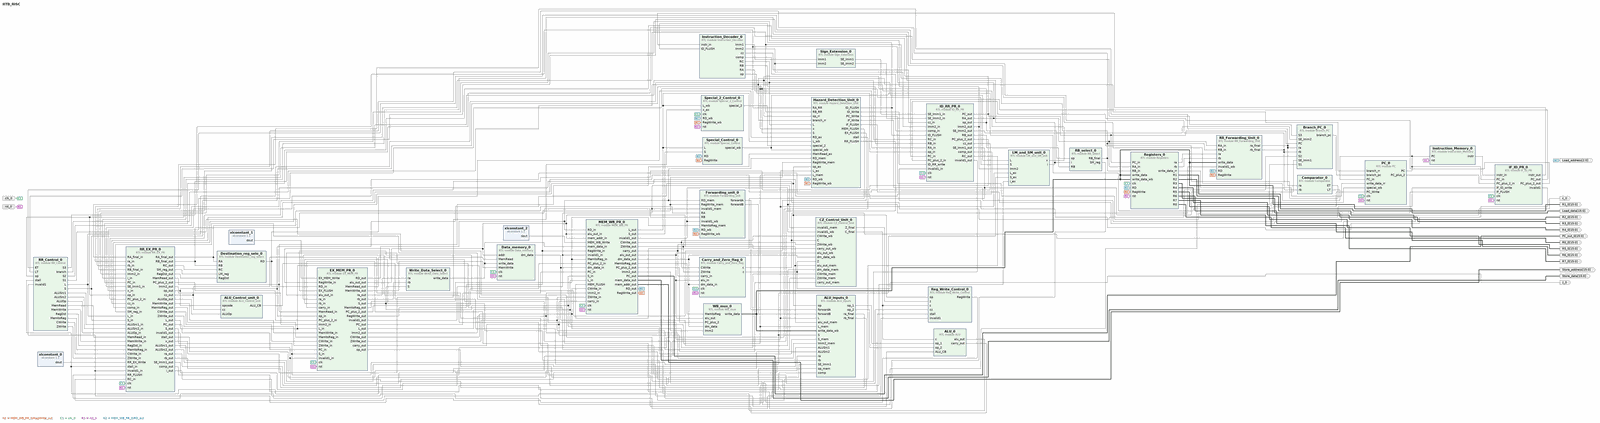
[diagram p0: block diagram of the top level, whole]
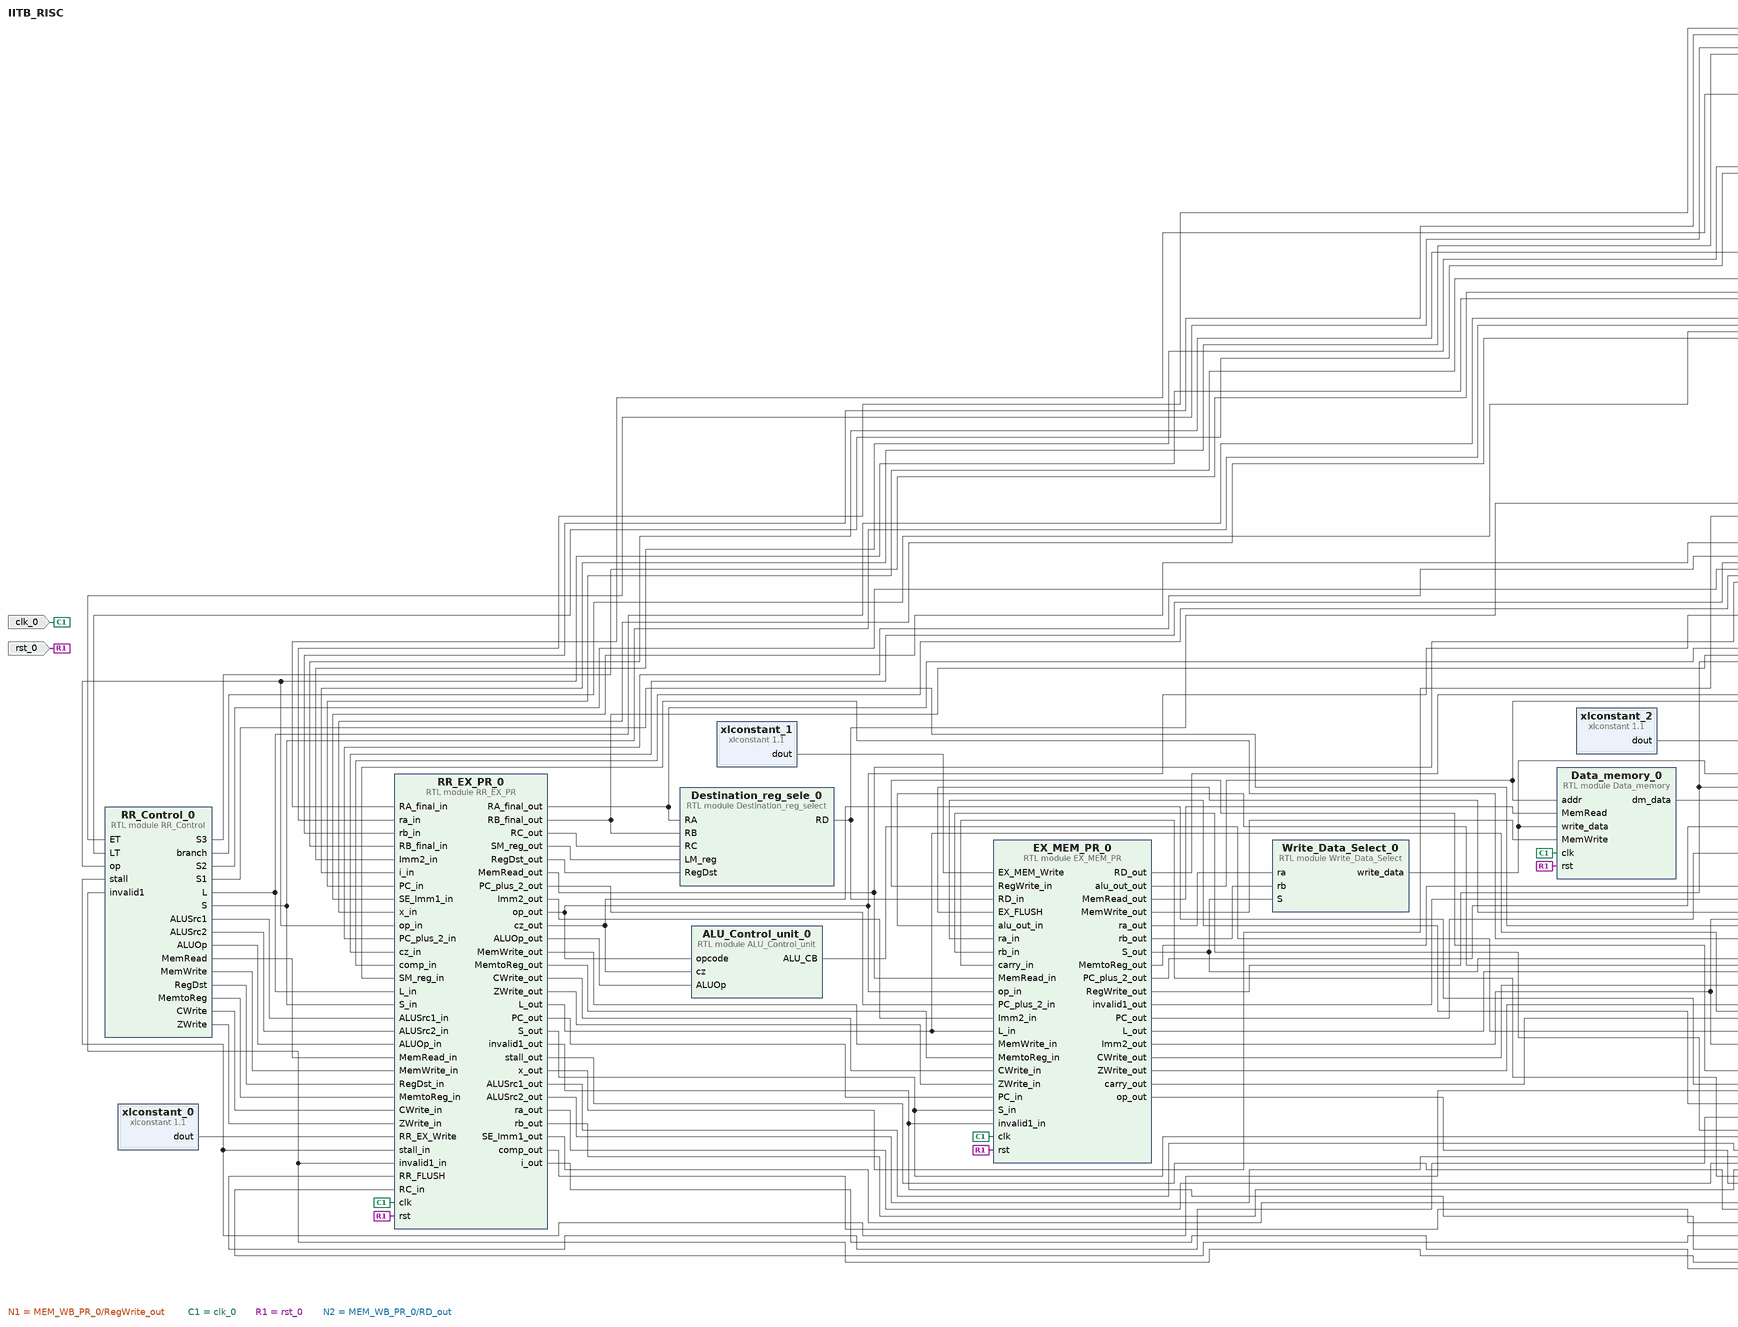
[diagram p1: block diagram of the top level, left part]
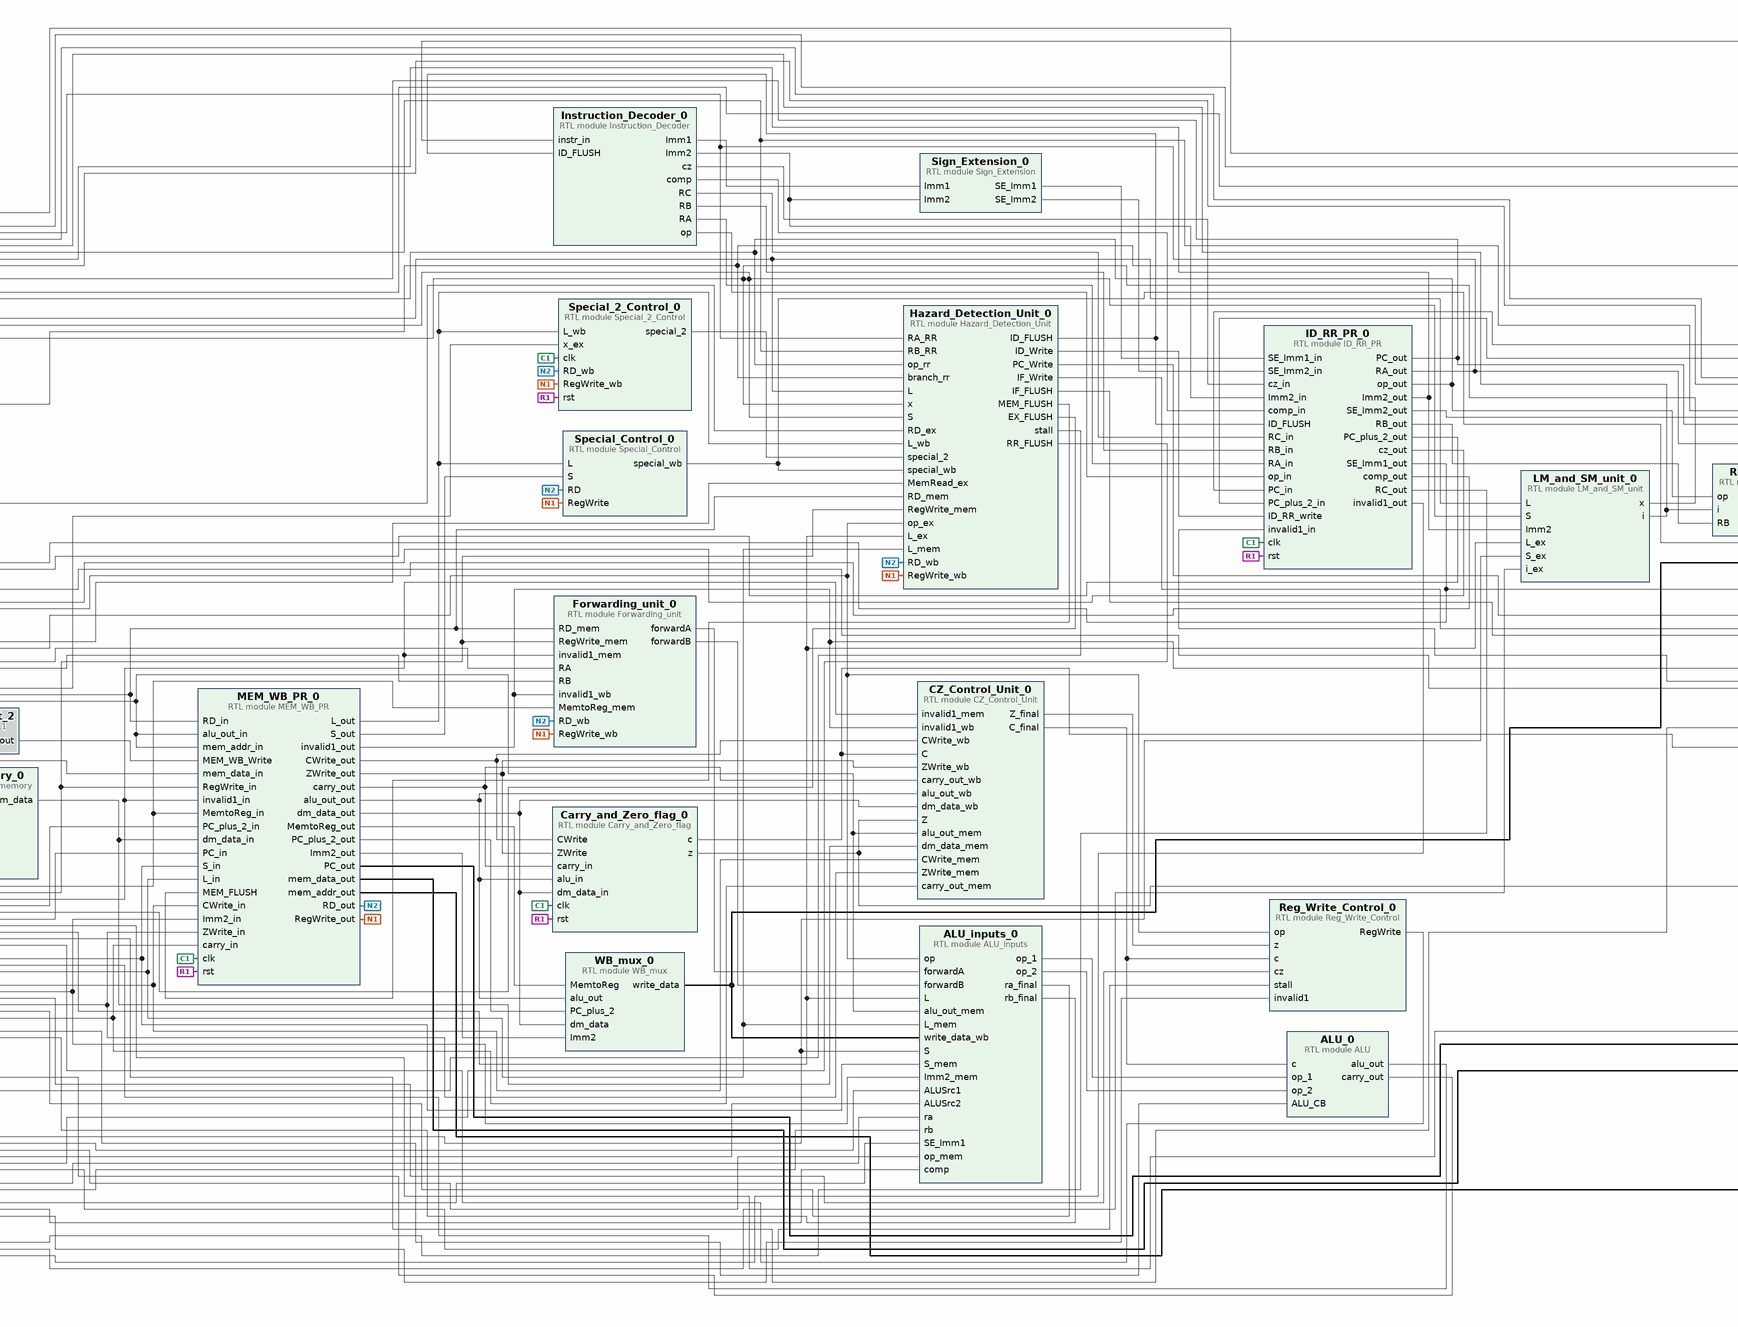
[diagram p2: block diagram of the top level, centre part]
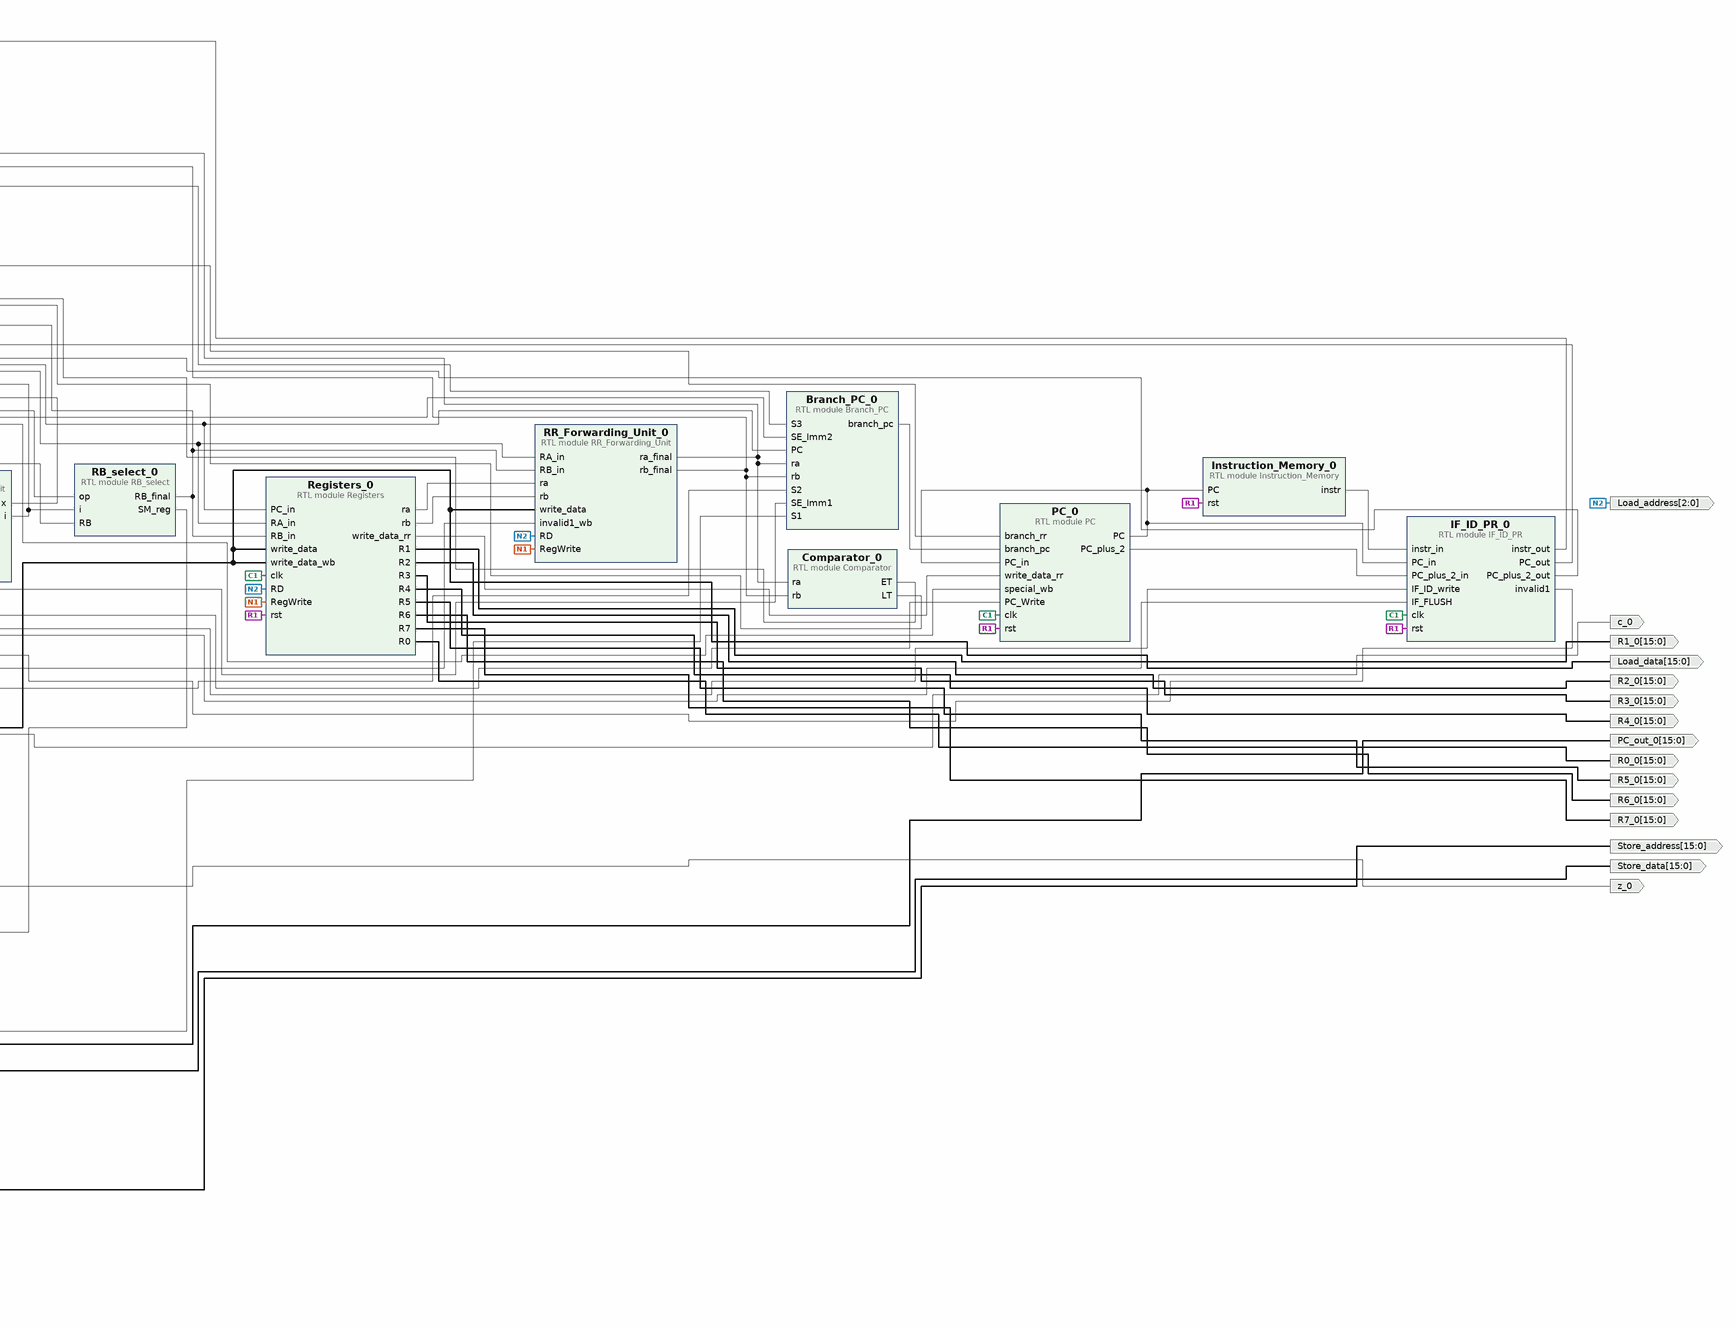
[diagram p3: block diagram of the top level, right part]
# Vivado block design IITB_RISC, xc7k70tfbv676-1, Vivado 2019.1
create_bd_design IITB_RISC

create_bd_port -dir I -type clk clk_0
create_bd_port -dir I -type rst rst_0
create_bd_port -dir O -from 15 -to 0 R1_0
create_bd_port -dir O -from 15 -to 0 R2_0
create_bd_port -dir O -from 15 -to 0 R3_0
create_bd_port -dir O -from 15 -to 0 R4_0
create_bd_port -dir O -from 15 -to 0 R5_0
create_bd_port -dir O -from 15 -to 0 R6_0
create_bd_port -dir O -from 15 -to 0 R7_0
create_bd_port -dir O -from 15 -to 0 PC_out_0
create_bd_port -dir O c_0
create_bd_port -dir O z_0
create_bd_port -dir O -from 15 -to 0 Load_data
create_bd_port -dir O -from 2 -to 0 Load_address
create_bd_port -dir O -from 15 -to 0 Store_data
create_bd_port -dir O -from 15 -to 0 Store_address
create_bd_port -dir O -from 15 -to 0 R0_0

create_bd_cell -type module -reference PC PC_0
create_bd_cell -type module -reference Sign_Extension Sign_Extension_0
create_bd_cell -type module -reference Comparator Comparator_0
create_bd_cell -type module -reference ALU_Control_unit ALU_Control_unit_0
create_bd_cell -type module -reference Destination_reg_select Destination_reg_sele_0
create_bd_cell -type module -reference Write_Data_Select Write_Data_Select_0
create_bd_cell -type module -reference WB_mux WB_mux_0
create_bd_cell -type module -reference Special_Control Special_Control_0
create_bd_cell -type ip -vlnv xilinx.com:ip:xlconstant:1.1 xlconstant_0
create_bd_cell -type ip -vlnv xilinx.com:ip:xlconstant:1.1 xlconstant_1
create_bd_cell -type ip -vlnv xilinx.com:ip:xlconstant:1.1 xlconstant_2
create_bd_cell -type module -reference Instruction_Decoder Instruction_Decoder_0
create_bd_cell -type module -reference Branch_PC Branch_PC_0
create_bd_cell -type module -reference ALU ALU_0
create_bd_cell -type module -reference ALU_inputs ALU_inputs_0
create_bd_cell -type module -reference RB_select RB_select_0
create_bd_cell -type module -reference LM_and_SM_unit LM_and_SM_unit_0
create_bd_cell -type module -reference Instruction_Memory Instruction_Memory_0
create_bd_cell -type module -reference Data_memory Data_memory_0
create_bd_cell -type module -reference Special_2_Control Special_2_Control_0
create_bd_cell -type module -reference Hazard_Detection_Unit Hazard_Detection_Unit_0
create_bd_cell -type module -reference Registers Registers_0
create_bd_cell -type module -reference ID_RR_PR ID_RR_PR_0
create_bd_cell -type module -reference IF_ID_PR IF_ID_PR_0
create_bd_cell -type module -reference Forwarding_unit Forwarding_unit_0
create_bd_cell -type module -reference Carry_and_Zero_flag Carry_and_Zero_flag_0
create_bd_cell -type module -reference CZ_Control_Unit CZ_Control_Unit_0
create_bd_cell -type module -reference MEM_WB_PR MEM_WB_PR_0
create_bd_cell -type module -reference EX_MEM_PR EX_MEM_PR_0
create_bd_cell -type module -reference RR_EX_PR RR_EX_PR_0
create_bd_cell -type module -reference Reg_Write_Control Reg_Write_Control_0
create_bd_cell -type module -reference RR_Control RR_Control_0
create_bd_cell -type module -reference RR_Forwarding_Unit RR_Forwarding_Unit_0

# ---- connections ----

connect_bd_net [get_bd_pins Instruction_Memory_0/instr] [get_bd_pins IF_ID_PR_0/instr_in]
connect_bd_net [get_bd_pins PC_0/PC_plus_2] [get_bd_pins IF_ID_PR_0/PC_plus_2_in]
connect_bd_net [get_bd_pins IF_ID_PR_0/instr_out] [get_bd_pins Instruction_Decoder_0/instr_in]
connect_bd_net [get_bd_pins Instruction_Decoder_0/Imm1] [get_bd_pins Sign_Extension_0/Imm1]
connect_bd_net [get_bd_pins Instruction_Decoder_0/Imm2] [get_bd_pins Sign_Extension_0/Imm2] [get_bd_pins ID_RR_PR_0/Imm2_in]
connect_bd_net [get_bd_pins Sign_Extension_0/SE_Imm1] [get_bd_pins ID_RR_PR_0/SE_Imm1_in]
connect_bd_net [get_bd_pins Sign_Extension_0/SE_Imm2] [get_bd_pins ID_RR_PR_0/SE_Imm2_in]
connect_bd_net [get_bd_pins Instruction_Decoder_0/cz] [get_bd_pins ID_RR_PR_0/cz_in]
connect_bd_net [get_bd_pins Instruction_Decoder_0/comp] [get_bd_pins ID_RR_PR_0/comp_in]
connect_bd_net [get_bd_pins Instruction_Decoder_0/RC] [get_bd_pins ID_RR_PR_0/RC_in]
connect_bd_net [get_bd_pins Instruction_Decoder_0/RB] [get_bd_pins ID_RR_PR_0/RB_in]
connect_bd_net [get_bd_pins Instruction_Decoder_0/RA] [get_bd_pins ID_RR_PR_0/RA_in]
connect_bd_net [get_bd_pins Instruction_Decoder_0/op] [get_bd_pins ID_RR_PR_0/op_in]
connect_bd_net [get_bd_pins IF_ID_PR_0/PC_out] [get_bd_pins ID_RR_PR_0/PC_in]
connect_bd_net [get_bd_pins IF_ID_PR_0/PC_plus_2_out] [get_bd_pins ID_RR_PR_0/PC_plus_2_in]
connect_bd_net [get_bd_pins ID_RR_PR_0/RA_out] \
  [get_bd_pins Hazard_Detection_Unit_0/RA_RR] [get_bd_pins Registers_0/RA_in] [get_bd_pins RR_EX_PR_0/RA_final_in] \
  [get_bd_pins RR_Forwarding_Unit_0/RA_in]
connect_bd_net -net Registers_0_ra [get_bd_pins RR_Forwarding_Unit_0/ra_final] \
  [get_bd_pins Comparator_0/ra] [get_bd_pins Branch_PC_0/ra] [get_bd_pins RR_EX_PR_0/ra_in]
connect_bd_net -net Registers_0_rb [get_bd_pins RR_Forwarding_Unit_0/rb_final] \
  [get_bd_pins Comparator_0/rb] [get_bd_pins Branch_PC_0/rb] [get_bd_pins RR_EX_PR_0/rb_in]
connect_bd_net [get_bd_pins RB_select_0/RB_final] \
  [get_bd_pins Hazard_Detection_Unit_0/RB_RR] [get_bd_pins Registers_0/RB_in] [get_bd_pins RR_EX_PR_0/RB_final_in] \
  [get_bd_pins RR_Forwarding_Unit_0/RB_in]
connect_bd_net [get_bd_pins ID_RR_PR_0/RB_out] [get_bd_pins RB_select_0/RB]
connect_bd_net [get_bd_pins ID_RR_PR_0/op_out] \
  [get_bd_pins RB_select_0/op] [get_bd_pins Hazard_Detection_Unit_0/op_rr] [get_bd_pins RR_EX_PR_0/op_in] \
  [get_bd_pins RR_Control_0/op]
connect_bd_net [get_bd_pins ID_RR_PR_0/Imm2_out] [get_bd_pins LM_and_SM_unit_0/Imm2] [get_bd_pins RR_EX_PR_0/Imm2_in]
connect_bd_net [get_bd_pins RR_Control_0/L] [get_bd_pins LM_and_SM_unit_0/L] [get_bd_pins Hazard_Detection_Unit_0/L] [get_bd_pins RR_EX_PR_0/L_in]
connect_bd_net [get_bd_pins RR_Control_0/S] [get_bd_pins LM_and_SM_unit_0/S] [get_bd_pins Hazard_Detection_Unit_0/S] [get_bd_pins RR_EX_PR_0/S_in]
connect_bd_net [get_bd_pins LM_and_SM_unit_0/i] [get_bd_pins RB_select_0/i] [get_bd_pins RR_EX_PR_0/i_in]
connect_bd_net [get_bd_pins Comparator_0/ET] [get_bd_pins RR_Control_0/ET]
connect_bd_net [get_bd_pins Comparator_0/LT] [get_bd_pins RR_Control_0/LT]
connect_bd_net [get_bd_pins ID_RR_PR_0/PC_out] [get_bd_pins Branch_PC_0/PC] [get_bd_pins Registers_0/PC_in] [get_bd_pins RR_EX_PR_0/PC_in]
connect_bd_net [get_bd_pins Registers_0/write_data_rr] [get_bd_pins PC_0/write_data_rr]
connect_bd_net [get_bd_pins RR_Control_0/S3] [get_bd_pins Branch_PC_0/S3]
connect_bd_net [get_bd_pins RR_Control_0/S2] [get_bd_pins Branch_PC_0/S2]
connect_bd_net [get_bd_pins RR_Control_0/S1] [get_bd_pins Branch_PC_0/S1]
connect_bd_net [get_bd_pins ID_RR_PR_0/SE_Imm1_out] [get_bd_pins Branch_PC_0/SE_Imm1] [get_bd_pins RR_EX_PR_0/SE_Imm1_in]
connect_bd_net [get_bd_pins ID_RR_PR_0/SE_Imm2_out] [get_bd_pins Branch_PC_0/SE_Imm2]
connect_bd_net [get_bd_pins LM_and_SM_unit_0/x] [get_bd_pins Hazard_Detection_Unit_0/x] [get_bd_pins RR_EX_PR_0/x_in]
connect_bd_net [get_bd_pins ID_RR_PR_0/PC_plus_2_out] [get_bd_pins RR_EX_PR_0/PC_plus_2_in]
connect_bd_net [get_bd_pins RR_Control_0/ALUSrc1] [get_bd_pins RR_EX_PR_0/ALUSrc1_in]
connect_bd_net [get_bd_pins RR_Control_0/ALUSrc2] [get_bd_pins RR_EX_PR_0/ALUSrc2_in]
connect_bd_net [get_bd_pins RR_Control_0/ALUOp] [get_bd_pins RR_EX_PR_0/ALUOp_in]
connect_bd_net [get_bd_pins RR_Control_0/MemRead] [get_bd_pins RR_EX_PR_0/MemRead_in]
connect_bd_net [get_bd_pins RR_Control_0/MemWrite] [get_bd_pins RR_EX_PR_0/MemWrite_in]
connect_bd_net [get_bd_pins RR_Control_0/RegDst] [get_bd_pins RR_EX_PR_0/RegDst_in]
connect_bd_net [get_bd_pins RR_Control_0/MemtoReg] [get_bd_pins RR_EX_PR_0/MemtoReg_in]
connect_bd_net [get_bd_pins RR_Control_0/branch] [get_bd_pins PC_0/branch_rr] [get_bd_pins Hazard_Detection_Unit_0/branch_rr]
connect_bd_net [get_bd_pins Branch_PC_0/branch_pc] [get_bd_pins PC_0/branch_pc]
connect_bd_net [get_bd_pins ID_RR_PR_0/cz_out] [get_bd_pins RR_EX_PR_0/cz_in]
connect_bd_net [get_bd_pins ID_RR_PR_0/comp_out] [get_bd_pins RR_EX_PR_0/comp_in]
connect_bd_net [get_bd_pins RB_select_0/SM_reg] [get_bd_pins RR_EX_PR_0/SM_reg_in]
connect_bd_net [get_bd_pins ALU_inputs_0/op_1] [get_bd_pins ALU_0/op_1]
connect_bd_net [get_bd_pins ALU_inputs_0/op_2] [get_bd_pins ALU_0/op_2]
connect_bd_net [get_bd_pins ALU_Control_unit_0/ALU_CB] [get_bd_pins ALU_0/ALU_CB]
connect_bd_net -net Carry_and_Zero_flag_0_c [get_bd_pins CZ_Control_Unit_0/C_final] [get_bd_pins ALU_0/c] [get_bd_pins Reg_Write_Control_0/c]
connect_bd_net [get_bd_pins RR_EX_PR_0/stall_out] [get_bd_pins Reg_Write_Control_0/stall]
connect_bd_net [get_bd_pins RR_EX_PR_0/op_out] \
  [get_bd_pins ALU_Control_unit_0/opcode] [get_bd_pins ALU_inputs_0/op] [get_bd_pins Hazard_Detection_Unit_0/op_ex] \
  [get_bd_pins EX_MEM_PR_0/op_in] [get_bd_pins Reg_Write_Control_0/op]
connect_bd_net [get_bd_pins RR_EX_PR_0/cz_out] [get_bd_pins ALU_Control_unit_0/cz] [get_bd_pins Reg_Write_Control_0/cz]
connect_bd_net [get_bd_pins Reg_Write_Control_0/RegWrite] [get_bd_pins EX_MEM_PR_0/RegWrite_in]
connect_bd_net [get_bd_pins ALU_0/alu_out] [get_bd_pins EX_MEM_PR_0/alu_out_in]
connect_bd_net [get_bd_pins RR_EX_PR_0/RA_final_out] [get_bd_pins Destination_reg_sele_0/RA] [get_bd_pins Forwarding_unit_0/RA]
connect_bd_net [get_bd_pins RR_EX_PR_0/RB_final_out] [get_bd_pins Destination_reg_sele_0/RB] [get_bd_pins Forwarding_unit_0/RB]
connect_bd_net [get_bd_pins RR_EX_PR_0/RC_out] [get_bd_pins Destination_reg_sele_0/RC]
connect_bd_net [get_bd_pins RR_EX_PR_0/SM_reg_out] [get_bd_pins Destination_reg_sele_0/LM_reg]
connect_bd_net [get_bd_pins Destination_reg_sele_0/RD] [get_bd_pins Hazard_Detection_Unit_0/RD_ex] [get_bd_pins EX_MEM_PR_0/RD_in]
connect_bd_net [get_bd_pins RR_EX_PR_0/RegDst_out] [get_bd_pins Destination_reg_sele_0/RegDst]
connect_bd_net [get_bd_pins RR_EX_PR_0/ALUSrc1_out] [get_bd_pins ALU_inputs_0/ALUSrc1]
connect_bd_net [get_bd_pins RR_EX_PR_0/ALUSrc2_out] [get_bd_pins ALU_inputs_0/ALUSrc2]
connect_bd_net [get_bd_pins RR_EX_PR_0/ALUOp_out] [get_bd_pins ALU_Control_unit_0/ALUOp]
connect_bd_net [get_bd_pins RR_EX_PR_0/ra_out] [get_bd_pins ALU_inputs_0/ra]
connect_bd_net [get_bd_pins RR_EX_PR_0/rb_out] [get_bd_pins ALU_inputs_0/rb]
connect_bd_net [get_bd_pins RR_EX_PR_0/SE_Imm1_out] [get_bd_pins ALU_inputs_0/SE_Imm1]
connect_bd_net [get_bd_pins RR_EX_PR_0/comp_out] [get_bd_pins ALU_inputs_0/comp]
connect_bd_net [get_bd_pins Forwarding_unit_0/forwardA] [get_bd_pins ALU_inputs_0/forwardA]
connect_bd_net [get_bd_pins Forwarding_unit_0/forwardB] [get_bd_pins ALU_inputs_0/forwardB]
connect_bd_net [get_bd_pins RR_EX_PR_0/PC_plus_2_out] [get_bd_pins EX_MEM_PR_0/PC_plus_2_in]
connect_bd_net [get_bd_pins RR_EX_PR_0/Imm2_out] [get_bd_pins EX_MEM_PR_0/Imm2_in]
connect_bd_net [get_bd_pins RR_EX_PR_0/L_out] \
  [get_bd_pins ALU_inputs_0/L] [get_bd_pins LM_and_SM_unit_0/L_ex] [get_bd_pins Hazard_Detection_Unit_0/L_ex] \
  [get_bd_pins EX_MEM_PR_0/L_in]
connect_bd_net [get_bd_pins RR_EX_PR_0/S_out] [get_bd_pins ALU_inputs_0/S] [get_bd_pins LM_and_SM_unit_0/S_ex] [get_bd_pins EX_MEM_PR_0/S_in]
connect_bd_net [get_bd_pins RR_EX_PR_0/MemRead_out] [get_bd_pins Hazard_Detection_Unit_0/MemRead_ex] [get_bd_pins EX_MEM_PR_0/MemRead_in]
connect_bd_net [get_bd_pins RR_EX_PR_0/MemWrite_out] [get_bd_pins EX_MEM_PR_0/MemWrite_in]
connect_bd_net [get_bd_pins RR_EX_PR_0/MemtoReg_out] [get_bd_pins EX_MEM_PR_0/MemtoReg_in]
connect_bd_net [get_bd_pins EX_MEM_PR_0/alu_out_out] \
  [get_bd_pins ALU_inputs_0/alu_out_mem] [get_bd_pins Data_memory_0/addr] [get_bd_pins CZ_Control_Unit_0/alu_out_mem] \
  [get_bd_pins MEM_WB_PR_0/alu_out_in] [get_bd_pins MEM_WB_PR_0/mem_addr_in]
connect_bd_net [get_bd_pins EX_MEM_PR_0/RD_out] \
  [get_bd_pins Hazard_Detection_Unit_0/RD_mem] [get_bd_pins Forwarding_unit_0/RD_mem] [get_bd_pins MEM_WB_PR_0/RD_in]
connect_bd_net [get_bd_pins EX_MEM_PR_0/L_out] \
  [get_bd_pins ALU_inputs_0/L_mem] [get_bd_pins Hazard_Detection_Unit_0/L_mem] [get_bd_pins MEM_WB_PR_0/L_in]
connect_bd_net [get_bd_pins EX_MEM_PR_0/S_out] [get_bd_pins Write_Data_Select_0/S] [get_bd_pins ALU_inputs_0/S_mem] [get_bd_pins MEM_WB_PR_0/S_in]
connect_bd_net [get_bd_pins EX_MEM_PR_0/MemRead_out] [get_bd_pins Data_memory_0/MemRead]
connect_bd_net [get_bd_pins EX_MEM_PR_0/MemWrite_out] [get_bd_pins Data_memory_0/MemWrite]
connect_bd_net [get_bd_pins EX_MEM_PR_0/MemtoReg_out] [get_bd_pins Forwarding_unit_0/MemtoReg_mem] [get_bd_pins MEM_WB_PR_0/MemtoReg_in]
connect_bd_net [get_bd_pins Write_Data_Select_0/write_data] [get_bd_pins Data_memory_0/write_data] [get_bd_pins MEM_WB_PR_0/mem_data_in]
connect_bd_net [get_bd_pins EX_MEM_PR_0/ra_out] [get_bd_pins Write_Data_Select_0/ra]
connect_bd_net [get_bd_pins EX_MEM_PR_0/rb_out] [get_bd_pins Write_Data_Select_0/rb]
connect_bd_net [get_bd_pins Data_memory_0/dm_data] [get_bd_pins CZ_Control_Unit_0/dm_data_mem] [get_bd_pins MEM_WB_PR_0/dm_data_in]
connect_bd_net [get_bd_pins EX_MEM_PR_0/PC_plus_2_out] [get_bd_pins MEM_WB_PR_0/PC_plus_2_in]
connect_bd_net [get_bd_pins EX_MEM_PR_0/Imm2_out] [get_bd_pins ALU_inputs_0/Imm2_mem] [get_bd_pins MEM_WB_PR_0/Imm2_in]
connect_bd_net [get_bd_pins EX_MEM_PR_0/RegWrite_out] \
  [get_bd_pins Hazard_Detection_Unit_0/RegWrite_mem] [get_bd_pins Forwarding_unit_0/RegWrite_mem] \
  [get_bd_pins MEM_WB_PR_0/RegWrite_in]
connect_bd_net [get_bd_pins MEM_WB_PR_0/MemtoReg_out] [get_bd_pins WB_mux_0/MemtoReg]
connect_bd_net [get_bd_pins MEM_WB_PR_0/alu_out_out] \
  [get_bd_pins WB_mux_0/alu_out] [get_bd_pins Carry_and_Zero_flag_0/alu_in] [get_bd_pins CZ_Control_Unit_0/alu_out_wb]
connect_bd_net [get_bd_pins MEM_WB_PR_0/dm_data_out] \
  [get_bd_pins WB_mux_0/dm_data] [get_bd_pins Carry_and_Zero_flag_0/dm_data_in] [get_bd_pins CZ_Control_Unit_0/dm_data_wb]
connect_bd_net [get_bd_pins MEM_WB_PR_0/PC_plus_2_out] [get_bd_pins WB_mux_0/PC_plus_2]
connect_bd_net [get_bd_pins MEM_WB_PR_0/Imm2_out] [get_bd_pins WB_mux_0/Imm2]
connect_bd_net [get_bd_pins MEM_WB_PR_0/RegWrite_out] \
  [get_bd_pins Special_Control_0/RegWrite] [get_bd_pins Special_2_Control_0/RegWrite_wb] \
  [get_bd_pins Hazard_Detection_Unit_0/RegWrite_wb] [get_bd_pins Registers_0/RegWrite] \
  [get_bd_pins Forwarding_unit_0/RegWrite_wb] [get_bd_pins RR_Forwarding_Unit_0/RegWrite]
connect_bd_net [get_bd_pins MEM_WB_PR_0/L_out] \
  [get_bd_pins Special_Control_0/L] [get_bd_pins Special_2_Control_0/L_wb] [get_bd_pins Hazard_Detection_Unit_0/L_wb]
connect_bd_net [get_bd_pins MEM_WB_PR_0/S_out] [get_bd_pins Special_Control_0/S]
connect_bd_net [get_bd_pins RR_EX_PR_0/x_out] [get_bd_pins Special_2_Control_0/x_ex]
connect_bd_net [get_bd_pins Special_Control_0/special_wb] [get_bd_pins PC_0/special_wb] [get_bd_pins Hazard_Detection_Unit_0/special_wb]
connect_bd_net [get_bd_pins Special_2_Control_0/special_2] [get_bd_pins Hazard_Detection_Unit_0/special_2]
connect_bd_net [get_bd_pins Hazard_Detection_Unit_0/PC_Write] [get_bd_pins PC_0/PC_Write]
connect_bd_net [get_bd_pins Hazard_Detection_Unit_0/IF_Write] [get_bd_pins IF_ID_PR_0/IF_ID_write]
connect_bd_net [get_bd_pins Hazard_Detection_Unit_0/ID_Write] [get_bd_pins ID_RR_PR_0/ID_RR_write]
connect_bd_net [get_bd_pins Hazard_Detection_Unit_0/stall] [get_bd_pins RR_EX_PR_0/stall_in] [get_bd_pins RR_Control_0/stall]
connect_bd_net [get_bd_pins Hazard_Detection_Unit_0/IF_FLUSH] [get_bd_pins IF_ID_PR_0/IF_FLUSH]
connect_bd_net [get_bd_pins Hazard_Detection_Unit_0/ID_FLUSH] [get_bd_pins Instruction_Decoder_0/ID_FLUSH] [get_bd_pins ID_RR_PR_0/ID_FLUSH]
connect_bd_net [get_bd_pins Hazard_Detection_Unit_0/RR_FLUSH] [get_bd_pins RR_EX_PR_0/RR_FLUSH]
connect_bd_net [get_bd_pins Hazard_Detection_Unit_0/EX_FLUSH] [get_bd_pins EX_MEM_PR_0/EX_FLUSH]
connect_bd_net [get_bd_pins Hazard_Detection_Unit_0/MEM_FLUSH] [get_bd_pins MEM_WB_PR_0/MEM_FLUSH]
connect_bd_net [get_bd_pins xlconstant_0/dout] [get_bd_pins RR_EX_PR_0/RR_EX_Write]
connect_bd_net [get_bd_pins xlconstant_1/dout] [get_bd_pins EX_MEM_PR_0/EX_MEM_Write]
connect_bd_net [get_bd_pins xlconstant_2/dout] [get_bd_pins MEM_WB_PR_0/MEM_WB_Write]
connect_bd_net [get_bd_pins ID_RR_PR_0/RC_out] [get_bd_pins RR_EX_PR_0/RC_in]
connect_bd_net -net clk_0_1 [get_bd_ports clk_0] \
  [get_bd_pins PC_0/clk] [get_bd_pins Data_memory_0/clk] [get_bd_pins Special_2_Control_0/clk] [get_bd_pins Registers_0/clk] \
  [get_bd_pins ID_RR_PR_0/clk] [get_bd_pins IF_ID_PR_0/clk] [get_bd_pins Carry_and_Zero_flag_0/clk] \
  [get_bd_pins MEM_WB_PR_0/clk] [get_bd_pins EX_MEM_PR_0/clk] [get_bd_pins RR_EX_PR_0/clk]
connect_bd_net -net rst_0_1 [get_bd_ports rst_0] \
  [get_bd_pins PC_0/rst] [get_bd_pins Instruction_Memory_0/rst] [get_bd_pins Data_memory_0/rst] \
  [get_bd_pins Special_2_Control_0/rst] [get_bd_pins Registers_0/rst] [get_bd_pins ID_RR_PR_0/rst] \
  [get_bd_pins IF_ID_PR_0/rst] [get_bd_pins Carry_and_Zero_flag_0/rst] [get_bd_pins MEM_WB_PR_0/rst] \
  [get_bd_pins EX_MEM_PR_0/rst] [get_bd_pins RR_EX_PR_0/rst]
connect_bd_net [get_bd_pins ALU_inputs_0/ra_final] [get_bd_pins EX_MEM_PR_0/ra_in]
connect_bd_net [get_bd_pins ALU_inputs_0/rb_final] [get_bd_pins EX_MEM_PR_0/rb_in]
connect_bd_net [get_bd_pins Registers_0/ra] [get_bd_pins RR_Forwarding_Unit_0/ra]
connect_bd_net [get_bd_pins Registers_0/rb] [get_bd_pins RR_Forwarding_Unit_0/rb]
connect_bd_net [get_bd_pins RR_Control_0/CWrite] [get_bd_pins RR_EX_PR_0/CWrite_in]
connect_bd_net [get_bd_pins RR_Control_0/ZWrite] [get_bd_pins RR_EX_PR_0/ZWrite_in]
connect_bd_net [get_bd_pins CZ_Control_Unit_0/Z_final] [get_bd_pins Reg_Write_Control_0/z]
connect_bd_net [get_bd_pins MEM_WB_PR_0/CWrite_out] [get_bd_pins Carry_and_Zero_flag_0/CWrite] [get_bd_pins CZ_Control_Unit_0/CWrite_wb]
connect_bd_net [get_bd_pins MEM_WB_PR_0/ZWrite_out] [get_bd_pins Carry_and_Zero_flag_0/ZWrite] [get_bd_pins CZ_Control_Unit_0/ZWrite_wb]
connect_bd_net [get_bd_pins EX_MEM_PR_0/CWrite_out] [get_bd_pins CZ_Control_Unit_0/CWrite_mem] [get_bd_pins MEM_WB_PR_0/CWrite_in]
connect_bd_net [get_bd_pins EX_MEM_PR_0/ZWrite_out] [get_bd_pins CZ_Control_Unit_0/ZWrite_mem] [get_bd_pins MEM_WB_PR_0/ZWrite_in]
connect_bd_net [get_bd_pins RR_EX_PR_0/CWrite_out] [get_bd_pins EX_MEM_PR_0/CWrite_in]
connect_bd_net [get_bd_pins RR_EX_PR_0/ZWrite_out] [get_bd_pins EX_MEM_PR_0/ZWrite_in]
connect_bd_net [get_bd_pins MEM_WB_PR_0/carry_out] [get_bd_pins Carry_and_Zero_flag_0/carry_in] [get_bd_pins CZ_Control_Unit_0/carry_out_wb]
connect_bd_net [get_bd_pins EX_MEM_PR_0/carry_out] [get_bd_pins CZ_Control_Unit_0/carry_out_mem] [get_bd_pins MEM_WB_PR_0/carry_in]
connect_bd_net [get_bd_pins ALU_0/carry_out] [get_bd_pins EX_MEM_PR_0/carry_in]
connect_bd_net [get_bd_pins RR_EX_PR_0/i_out] [get_bd_pins LM_and_SM_unit_0/i_ex]
connect_bd_net [get_bd_pins EX_MEM_PR_0/op_out] [get_bd_pins ALU_inputs_0/op_mem]
connect_bd_net [get_bd_pins EX_MEM_PR_0/PC_out] [get_bd_pins MEM_WB_PR_0/PC_in]
connect_bd_net [get_bd_pins RR_EX_PR_0/PC_out] [get_bd_pins EX_MEM_PR_0/PC_in]
connect_bd_net [get_bd_pins Registers_0/R1] [get_bd_ports R1_0]
connect_bd_net [get_bd_pins Registers_0/R2] [get_bd_ports R2_0]
connect_bd_net [get_bd_pins Registers_0/R3] [get_bd_ports R3_0]
connect_bd_net [get_bd_pins Registers_0/R4] [get_bd_ports R4_0]
connect_bd_net [get_bd_pins Registers_0/R5] [get_bd_ports R5_0]
connect_bd_net [get_bd_pins Registers_0/R6] [get_bd_ports R6_0]
connect_bd_net [get_bd_pins Registers_0/R7] [get_bd_ports R7_0]
connect_bd_net [get_bd_pins MEM_WB_PR_0/PC_out] [get_bd_ports PC_out_0]
connect_bd_net [get_bd_pins Carry_and_Zero_flag_0/c] [get_bd_ports c_0] [get_bd_pins CZ_Control_Unit_0/C]
connect_bd_net [get_bd_pins Carry_and_Zero_flag_0/z] [get_bd_ports z_0] [get_bd_pins CZ_Control_Unit_0/Z]
connect_bd_net [get_bd_pins WB_mux_0/write_data] \
  [get_bd_ports Load_data] [get_bd_pins ALU_inputs_0/write_data_wb] [get_bd_pins Registers_0/write_data] \
  [get_bd_pins Registers_0/write_data_wb] [get_bd_pins RR_Forwarding_Unit_0/write_data]
connect_bd_net [get_bd_pins MEM_WB_PR_0/RD_out] \
  [get_bd_ports Load_address] [get_bd_pins Special_Control_0/RD] [get_bd_pins Special_2_Control_0/RD_wb] \
  [get_bd_pins Hazard_Detection_Unit_0/RD_wb] [get_bd_pins Registers_0/RD] [get_bd_pins Forwarding_unit_0/RD_wb] \
  [get_bd_pins RR_Forwarding_Unit_0/RD]
connect_bd_net [get_bd_pins MEM_WB_PR_0/mem_data_out] [get_bd_ports Store_data]
connect_bd_net [get_bd_pins MEM_WB_PR_0/mem_addr_out] [get_bd_ports Store_address]
connect_bd_net [get_bd_pins PC_0/PC] [get_bd_pins PC_0/PC_in] [get_bd_pins Instruction_Memory_0/PC] [get_bd_pins IF_ID_PR_0/PC_in]
connect_bd_net [get_bd_pins Registers_0/R0] [get_bd_ports R0_0]
connect_bd_net [get_bd_pins IF_ID_PR_0/invalid1] [get_bd_pins ID_RR_PR_0/invalid1_in]
connect_bd_net [get_bd_pins ID_RR_PR_0/invalid1_out] [get_bd_pins RR_EX_PR_0/invalid1_in] [get_bd_pins RR_Control_0/invalid1]
connect_bd_net [get_bd_pins RR_EX_PR_0/invalid1_out] [get_bd_pins EX_MEM_PR_0/invalid1_in] [get_bd_pins Reg_Write_Control_0/invalid1]
connect_bd_net [get_bd_pins EX_MEM_PR_0/invalid1_out] \
  [get_bd_pins Forwarding_unit_0/invalid1_mem] [get_bd_pins CZ_Control_Unit_0/invalid1_mem] \
  [get_bd_pins MEM_WB_PR_0/invalid1_in]
connect_bd_net [get_bd_pins MEM_WB_PR_0/invalid1_out] \
  [get_bd_pins Forwarding_unit_0/invalid1_wb] [get_bd_pins CZ_Control_Unit_0/invalid1_wb] \
  [get_bd_pins RR_Forwarding_Unit_0/invalid1_wb]

validate_bd_design
save_bd_design
